# Altium schematic sheet RFR24 AMS Design - Power Supply V1.SchDoc
size A; SheetNumber: 5; SheetTotal: 10
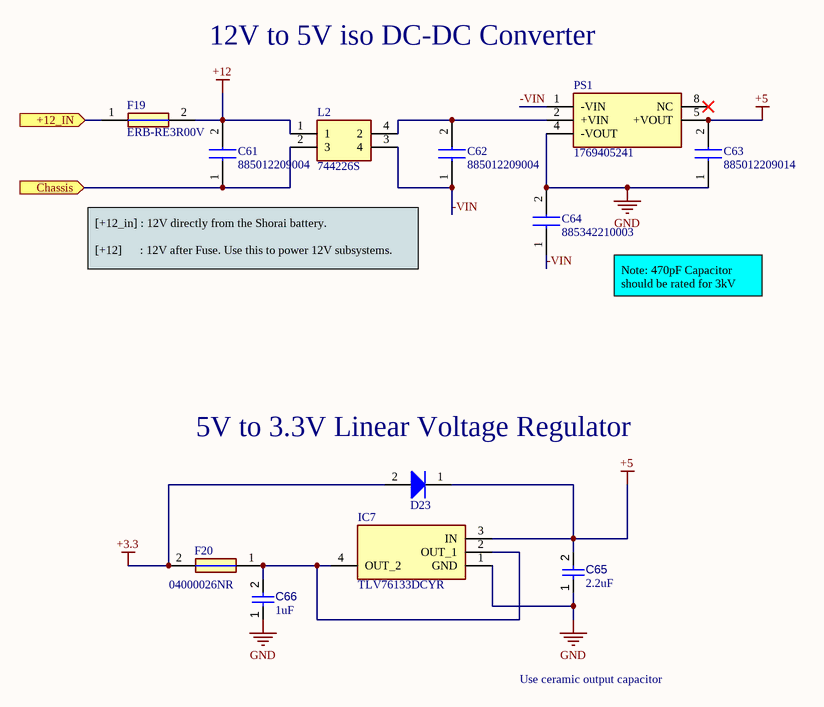
[diagram p0: RFR24 AMS Design - Power Supply V1.SchDoc]

## Parts
C61  885012209004  [CAPC3225X220N]
C62  885012209004  [CAPC3225X220N]
C63  885012209014  [CAPC3225X220N]
C64  885342210003  [CAPC4620X220N]
C65  value 2.2uF  [CAPC2013X145X50LL20T25]  (hidden comment: Capacitor 1 uF +/- 10% 25 V 0805)
C66  value 1uF  [CAPC2013X145X50LL20T25]  (hidden comment: Capacitor 1 uF +/- 10% 25 V 0805)
D23  unknown  [INF-SOD323_V]  (value not drawn)
F19  ERB-RE3R00V  [ERBRE0R50V]
F20  04000026NR  [FUSC1508X58N]
IC7  TLV76133DCYR  [SOT230P700X180-4N]
L2  744226S  [WE-SL274]
PS1  1769405241  [1769405241]

## Ports
+12_IN (in), Chassis (in)

## Nets
+3.3: D23.2(A) F20.2
+5: C63.2 C65.2 D23.1(K) IC7.3(IN) PS1.5(+VOUT)
+12: C61.2 F19.2 L2.1
GND: C63.1 C64.2 C65.1 C66.1 IC7.1(GND) PS1.4(-VOUT)
+12_IN: F19.1 ; port +12_IN
-VIN: C62.1 C64.1 L2.3(4) PS1.1(-VIN)
Chassis: C61.1 L2.2(3) ; port Chassis
NetC62_2: C62.2 L2.4(2) PS1.2(+VIN)
NetC66_2: C66.2 F20.1 IC7.2(OUT_1) IC7.4(OUT_2)

Not connected (* = marked no-connect by the designer): PS1 8(NC)*

## Notes on the sheet
- 12V to 5V iso DC-DC Converter
- [+12_in] : 12V directly from the Shorai battery.
  [+12]      : 12V after Fuse. Use this to power 12V subsystems.
- Note: 470pF Capacitor should be rated for 3kV
- (near D23) 5V to 3.3V Linear Voltage Regulator
- Use ceramic output capacitor

## Library data of the parts
C61 C62 = 885012209004: Capacitor; Manufacturer_Name: Wurth Elektronik; Datasheet Link: https://katalog.we-online.com/pbs/datasheet/885012209004.pdf; Height: 2.2mm; Manufacturer_Part_Number: 885012209004; Mouser Part Number: 710-885012209004; Mouser Price/Stock: https://www.mouser.com/Search/Refine.aspx?Keyword=710-885012209004
C63 = 885012209014: Capacitor; Manufacturer_Name: Wurth Elektronik; Datasheet Link: https://katalog.we-online.com/pbs/datasheet/885012209014.pdf; Height: 2.2mm; Manufacturer_Part_Number: 885012209014; Mouser Part Number: 710-885012209014; Mouser Price/Stock: https://www.mouser.com/Search/Refine.aspx?Keyword=710-885012209014
C64 = 885342210003: Capacitor; Manufacturer_Name: Wurth Elektronik; Datasheet Link: https://katalog.we-online.com/pbs/datasheet/885342210003.pdf; Height: 2.2mm; Manufacturer_Part_Number: 885342210003; Mouser Part Number: 710-885342210003; Mouser Price/Stock: https://www.mouser.co.uk/ProductDetail/Wurth-Elektronik/885342210003?qs=MLItCLRbWsxO%2Fvro%2Fk5QUQ%3D%3D
C65 C66 = CMP-001-00010-6: Chip Capacitor, 1 uF, +/-10%, 25 V, 0805 (2012 Metric); Capacitor Type: Ceramic; Voltage Rating: 25V; RoHS Compliant: True; Pins: 2; Mounting Technology: SM; Max Operating Temperature: 125°C; Min Operating Temperature: -55°C; Tolerance: 10%; Case/Package: 0805
D23 = CMP-1182-00005-1: Silicon Schottky Diode, -55 to 125 degC, SOD323, Reel, Green; PartNumber: BAS170W; Manufacturer: Infineon; Green: TRUE; VF (max): 1,000Â mV; VR (max): 70Â V; Configuration: Single; CT (max): 2Â pF; IF (max): 70Â mA; PackageReference: SOD323; ComponentLink3URL: http://www.infineon.com/dgdl/SOD323-Package_Overview.pdf?folderId=db3a30431936bc4b011952aab84f3bbe&fileId=db3a30431936bc4b011952beed653be3; PackageDescription: 2-Pin Small Outline Diode Package, 1.25 x 1.7 mm Body; ComponentLink2URL: http://www.infineon.com/dgdl/bas70_bas170series.pdf?folderId=db3a30431400ef68011425f1ca2505e3&fileId=db3a304314dca389011518ad41680e12; ComponentLink3Description: Package Specification; ComponentLink1URL: http://www.infineon.com/; ComponentLink1Description: Manufacturer URL; Packing: Reel; ComponentLink2Description: Datasheet; Mounting Technology: Surface Mount
F19 = ERB-RE3R00V: Fuse; Manufacturer_Name: Panasonic; Datasheet Link: https://industrial.panasonic.com/cdbs/www-data/pdf/AFA0000/AFA0000C7.pdf; Height: 0.64mm; Manufacturer_Part_Number: ERB-RE3R00V; Mouser Part Number: 667-ERB-RE3R00V; Mouser Price/Stock: https://www.mouser.co.uk/ProductDetail/Panasonic/ERB-RE3R00V?qs=YIEcsSB2Lz476AVmswLSkg%3D%3D; Arrow Part Number: ERB-RE3R00V; Arrow Price/Stock: https://www.arrow.com/en/products/erbre3r00v/panasonic?region=nac
F20 = 04000026NR: Fuse; Manufacturer_Name: LITTELFUSE; Datasheet Link: https://www.mouser.com/catalog/specsheets/Littelfuse_07032019_Fuse_400M_Datasheet.pdf; Height: 0.582mm; Manufacturer_Part_Number: 04000026NR; Mouser Part Number: 576-04000026NR; Mouser Price/Stock: https://www.mouser.co.uk/ProductDetail/Littelfuse/04000026NR?qs=byeeYqUIh0MItL5FgjMqyw%3D%3D; Arrow Part Number: 04000026NR; Arrow Price/Stock: https://www.arrow.com/en/products/04000026nr/littelfuse?region=nac
IC7 = TLV76133DCYR: Integrated Circuit; Manufacturer_Name: Texas Instruments; Datasheet Link: https://www.ti.com/lit/ds/symlink/tlv761.pdf?ts=1679984111185&ref_url=https%253A%252F%252Fwww.ti.com%252Fsitesearch%252Fen-us%252Fdocs%252Funiversalsearch.tsp%253FlangPref%253Den-US%2526searchTerm%253DTLV76133DCYR%2526nr%253D2; Height: 1.8mm; Manufacturer_Part_Number: TLV76133DCYR; Mouser Part Number: 595-TLV76133DCYR; Mouser Price/Stock: https://www.mouser.co.uk/ProductDetail/Texas-Instruments/TLV76133DCYR?qs=9vOqFld9vZV5BPjUhjTZUA%3D%3D; Arrow Part Number: TLV76133DCYR; Arrow Price/Stock: https://www.arrow.com/en/products/tlv76133dcyr/texas-instruments?region=nac
L2 = 744226S: Inductor; Manufacturer_Name: Wurth Elektronik; Datasheet Link: http://componentsearchengine.com/Datasheets/3/744226S.pdf; Manufacturer_Part_Number: 744226S; Mouser Part Number: 710-744226S; Mouser Price/Stock: https://www.mouser.co.uk/ProductDetail/Wurth-Elektronik/744226S?qs=PGXP4M47uW7i1tILwHyAXg%3D%3D
PS1 = 1769405241: Power Supply; Manufacturer_Name: Wurth Elektronik; Datasheet Link: https://www.we-online.com/components/products/datasheet/1769405241.pdf; Height: 7.5mm; Manufacturer_Part_Number: 1769405241